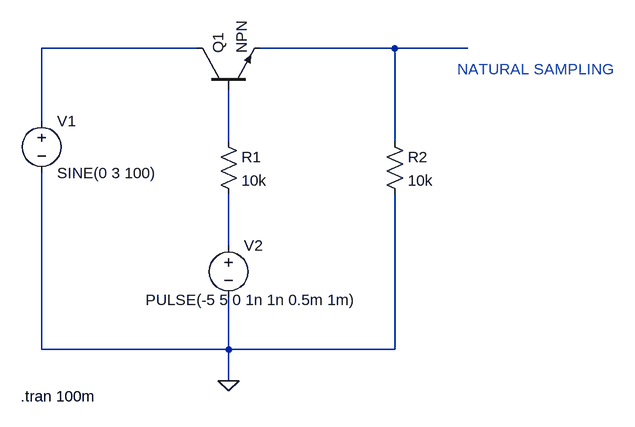
[diagram p0: schematic Natural sampling.asc]
Natural sampling.asc, the LTspice schematic file:
Version 4
SHEET 1 880 776
WIRE 160 224 -80 224
WIRE 464 224 256 224
WIRE 576 224 464 224
WIRE -80 336 -80 224
WIRE 208 368 208 288
WIRE 464 368 464 224
WIRE 208 528 208 448
WIRE -80 688 -80 416
WIRE 208 688 208 608
WIRE 208 688 -80 688
WIRE 464 688 464 448
WIRE 464 688 208 688
WIRE 208 736 208 688
FLAG 208 736 0
SYMBOL npn 160 288 R270
SYMATTR InstName Q1
SYMBOL voltage -80 320 R0
WINDOW 123 0 0 Left 0
WINDOW 39 0 0 Left 0
SYMATTR InstName V1
SYMATTR Value SINE(0 3 100)
SYMBOL voltage 208 512 R0
WINDOW 3 -128 100 Left 2
WINDOW 123 0 0 Left 0
WINDOW 39 0 0 Left 0
SYMATTR InstName V2
SYMATTR Value PULSE(-5 5 0 1n 1n 0.5m 1m)
SYMBOL res 192 352 R0
SYMATTR InstName R1
SYMATTR Value 10k
SYMBOL res 448 352 R0
SYMATTR InstName R2
SYMATTR Value 10k
TEXT -112 760 Left 2 !.tran 100m
TEXT 560 256 Left 2 ;NATURAL SAMPLING

The netlist it stands for:
* Natural sampling.asc
Q1 N001 N003 N002 0 NPN
V1 N001 0 SINE(0 3 100)
V2 N004 0 PULSE(-5 5 0 1n 1n 0.5m 1m)
R1 N003 N004 10k
R2 N002 0 10k
.model NPN NPN
.model PNP PNP
.lib standard.bjt
.tran 100m
* NATURAL SAMPLING
.backanno
.end